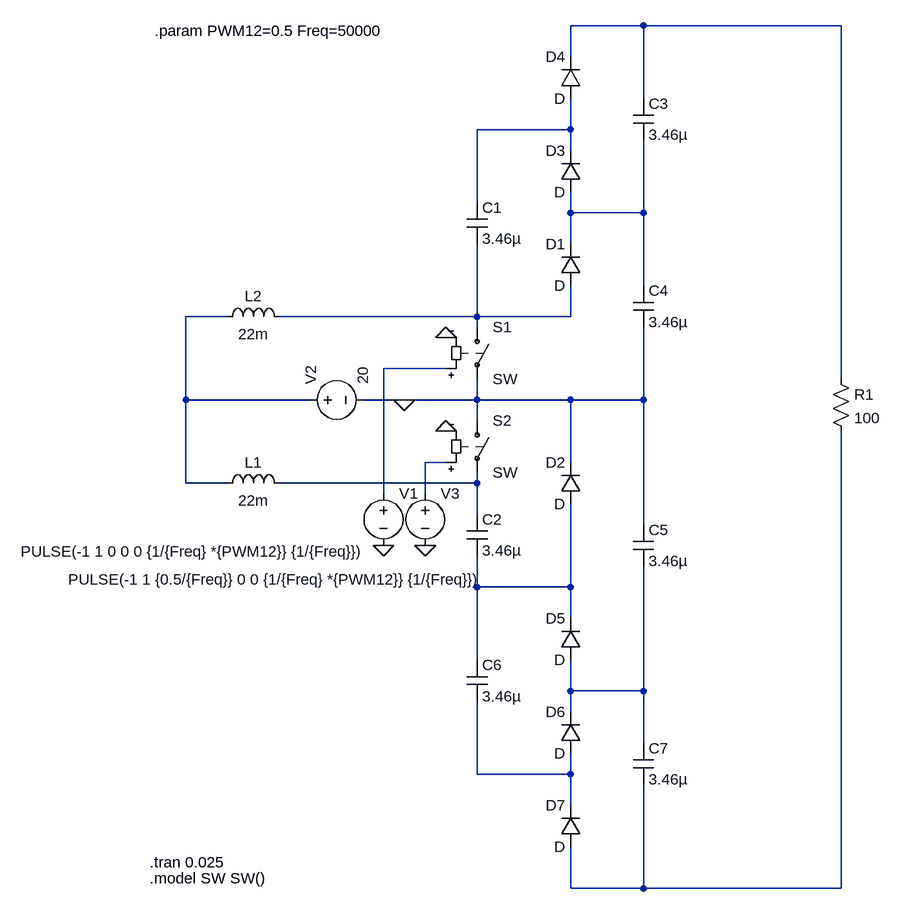
[diagram p0: schematic 1Nx.asc]
1Nx.asc, the LTspice schematic file:
Version 4
SHEET 1 1520 1864
WIRE 704 400 592 400
WIRE 1008 400 704 400
WIRE 592 448 592 400
WIRE 704 512 704 400
WIRE 592 560 592 512
WIRE 592 560 448 560
WIRE 592 592 592 560
WIRE 448 672 448 560
WIRE 592 688 592 656
WIRE 704 688 704 576
WIRE 704 688 592 688
WIRE 592 736 592 688
WIRE 704 800 704 688
WIRE 64 848 0 848
WIRE 448 848 448 736
WIRE 448 848 144 848
WIRE 592 848 592 800
WIRE 592 848 448 848
WIRE 448 864 448 848
WIRE 400 928 304 928
WIRE 1008 944 1008 400
WIRE 0 976 0 848
WIRE 192 976 0 976
WIRE 336 976 272 976
WIRE 448 976 448 944
WIRE 448 976 336 976
WIRE 592 976 448 976
WIRE 704 976 704 864
WIRE 704 976 592 976
WIRE 448 1008 448 976
WIRE 400 1072 368 1072
WIRE 592 1072 592 976
WIRE 0 1104 0 976
WIRE 64 1104 0 1104
WIRE 448 1104 448 1088
WIRE 448 1104 144 1104
WIRE 304 1120 304 928
WIRE 368 1120 368 1072
WIRE 448 1152 448 1104
WIRE 704 1168 704 976
WIRE 448 1264 448 1216
WIRE 592 1264 592 1136
WIRE 592 1264 448 1264
WIRE 592 1312 592 1264
WIRE 448 1376 448 1264
WIRE 592 1424 592 1376
WIRE 704 1424 704 1232
WIRE 704 1424 592 1424
WIRE 592 1456 592 1424
WIRE 704 1504 704 1424
WIRE 448 1552 448 1440
WIRE 592 1552 592 1520
WIRE 592 1552 448 1552
WIRE 592 1600 592 1552
WIRE 592 1728 592 1664
WIRE 704 1728 704 1568
WIRE 704 1728 592 1728
WIRE 1008 1728 1008 1024
WIRE 1008 1728 704 1728
FLAG 400 1024 0
FLAG 400 880 0
FLAG 336 976 0
FLAG 304 1200 0
FLAG 368 1200 0
SYMBOL voltage 176 976 R270
WINDOW 123 0 0 Left 2
WINDOW 39 0 0 Left 2
SYMATTR InstName V2
SYMATTR Value 20
SYMBOL sw 448 848 R0
SYMATTR InstName S1
SYMBOL sw 448 992 R0
SYMATTR InstName S2
SYMBOL ind 48 1120 R270
WINDOW 0 32 56 VTop 2
WINDOW 3 5 56 VBottom 2
SYMATTR InstName L1
SYMATTR Value 22m
SYMBOL ind 48 864 R270
WINDOW 0 32 56 VTop 2
WINDOW 3 5 56 VBottom 2
SYMATTR InstName L2
SYMATTR Value 22m
SYMBOL cap 432 672 R0
SYMATTR InstName C1
SYMATTR Value 3.46µ
SYMBOL cap 432 1152 R0
SYMATTR InstName C2
SYMATTR Value 3.46µ
SYMBOL cap 688 800 R0
SYMATTR InstName C4
SYMATTR Value 3.46µ
SYMBOL cap 688 1168 R0
SYMATTR InstName C5
SYMATTR Value 3.46µ
SYMBOL diode 608 800 R180
WINDOW 0 24 64 Left 2
WINDOW 3 24 0 Left 2
SYMATTR InstName D1
SYMBOL diode 608 1136 R180
WINDOW 0 24 64 Left 2
WINDOW 3 24 0 Left 2
SYMATTR InstName D2
SYMBOL diode 608 656 R180
WINDOW 0 24 64 Left 2
WINDOW 3 24 0 Left 2
SYMATTR InstName D3
SYMBOL diode 608 512 R180
WINDOW 0 24 64 Left 2
WINDOW 3 24 0 Left 2
SYMATTR InstName D4
SYMBOL cap 688 512 R0
SYMATTR InstName C3
SYMATTR Value 3.46µ
SYMBOL diode 608 1376 R180
WINDOW 0 24 64 Left 2
WINDOW 3 24 0 Left 2
SYMATTR InstName D5
SYMBOL diode 608 1520 R180
WINDOW 0 24 64 Left 2
WINDOW 3 24 0 Left 2
SYMATTR InstName D6
SYMBOL diode 608 1664 R180
WINDOW 0 24 64 Left 2
WINDOW 3 24 0 Left 2
SYMATTR InstName D7
SYMBOL cap 432 1376 R0
SYMATTR InstName C6
SYMATTR Value 3.46µ
SYMBOL cap 688 1504 R0
SYMATTR InstName C7
SYMATTR Value 3.46µ
SYMBOL res 992 928 R0
SYMATTR InstName R1
SYMATTR Value 100
SYMBOL voltage 304 1104 R0
WINDOW 3 -558 105 Left 2
WINDOW 123 0 0 Left 2
WINDOW 39 0 0 Left 2
SYMATTR Value PULSE(-1 1 0 0 0 {1/{Freq} *{PWM12}} {1/{Freq}})
SYMATTR InstName V1
SYMBOL voltage 368 1104 R0
WINDOW 3 -549 148 Left 2
WINDOW 123 0 0 Left 2
WINDOW 39 0 0 Left 2
SYMATTR Value PULSE(-1 1 {0.5/{Freq}} 0 0 {1/{Freq} *{PWM12}} {1/{Freq}})
SYMATTR InstName V3
TEXT -56 1688 Left 2 !.tran 0.025
TEXT -56 1712 Left 2 !.model SW SW()
TEXT -48 408 Left 2 !.param PWM12=0.5 Freq=50000

The netlist it stands for:
* 1Nx.asc
V2 N004 0 20
S1 N005 0 N006 0 SW
S2 0 N008 N007 0 SW
L1 N004 N008 22m
L2 N004 N005 22m
C1 N002 N005 3.46µ
C2 N008 N009 3.46µ
C4 N003 0 3.46µ
C5 0 N010 3.46µ
D1 N005 N003 D
D2 N009 0 D
D3 N003 N002 D
D4 N002 N001 D
C3 N001 N003 3.46µ
D5 N010 N009 D
D6 N011 N010 D
D7 N012 N011 D
C6 N009 N011 3.46µ
C7 N010 N012 3.46µ
R1 N001 N012 100
V1 N006 0 PULSE(-1 1 0 0 0 {1/{Freq} *{PWM12}} {1/{Freq}})
V3 N007 0 PULSE(-1 1 {0.5/{Freq}} 0 0 {1/{Freq} *{PWM12}} {1/{Freq}})
.model D D
.lib standard.dio
.tran 0.025
.model SW SW()
.param PWM12=0.5 Freq=50000
.backanno
.end